# Altium schematic sheet LED Lamp Interfaces.SchDoc
size A4; Organization: TESLA Motors, INC; Address1: 3500 Deer Creek Road; Address2: Palo Alto, CA; Address4: U.S.A.; SheetNumber: 17; SheetTotal: 21
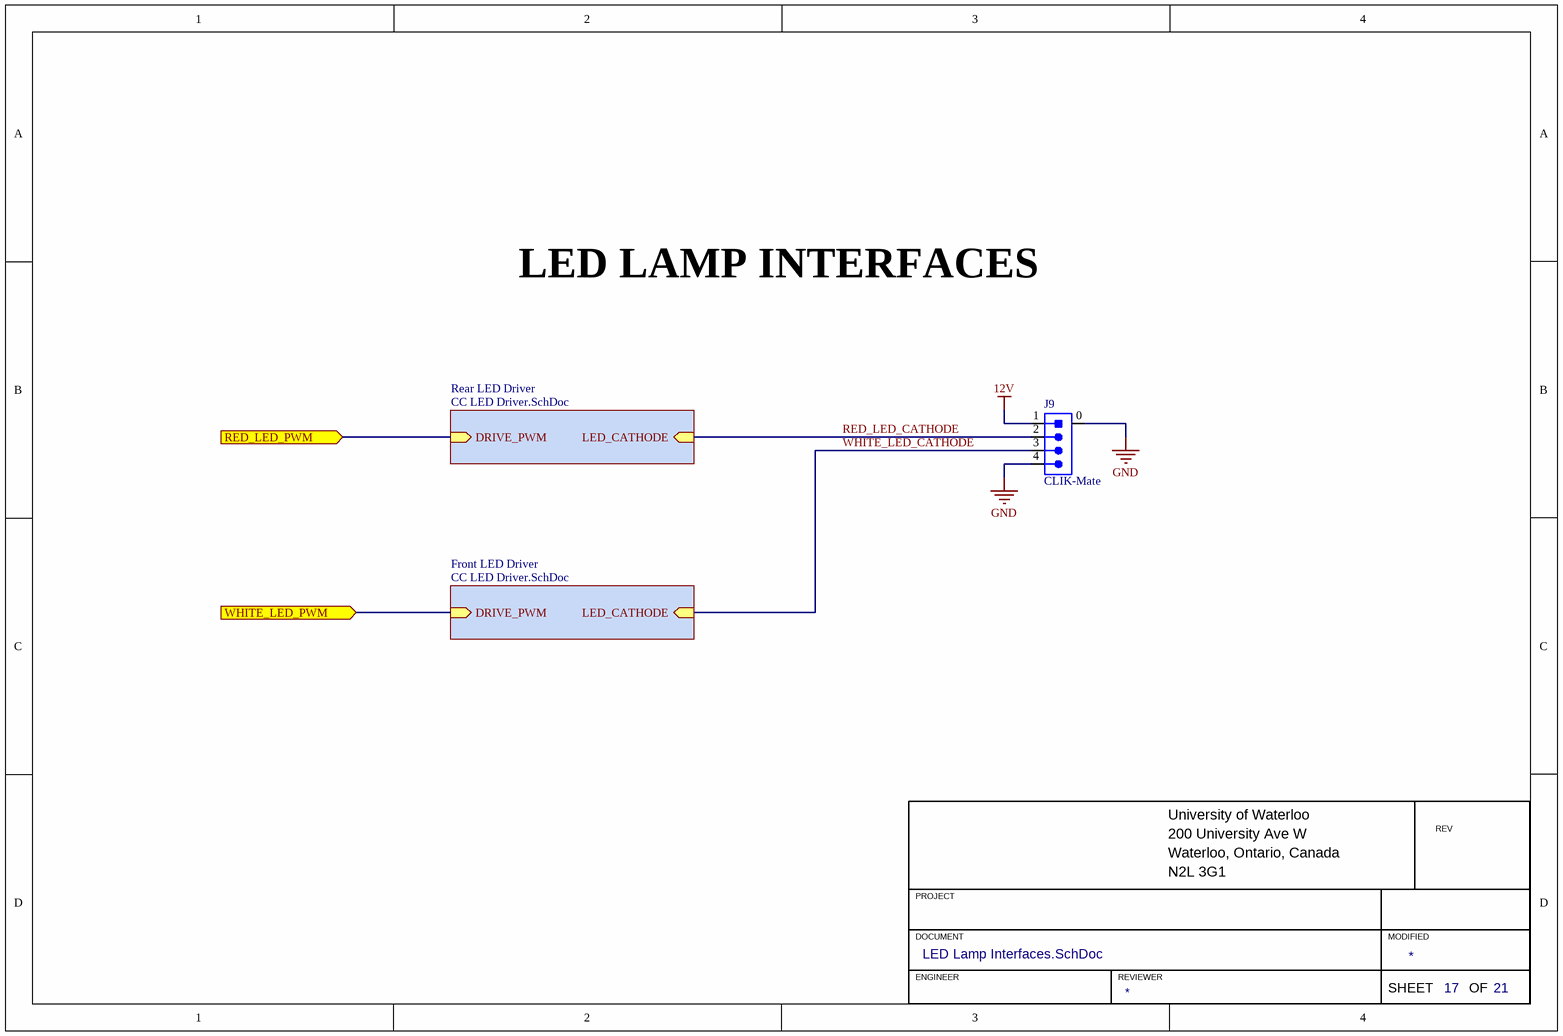
[diagram p0: LED Lamp Interfaces.SchDoc]

## Parts
J9  Family: CLIK-Mate  [MOLEX-5025850470]  (hidden comment: CON_4M_SM_RA)

## Sub-sheets
Front LED Driver = CC LED Driver.SchDoc: LED_CATHODE (in), DRIVE_PWM (in)
Rear LED Driver = CC LED Driver.SchDoc: LED_CATHODE (in), DRIVE_PWM (in)

## Ports
RED_LED_PWM (in), WHITE_LED_PWM (in)

## Nets
12V: J9.1
GND: J9.0 J9.4
RED_LED_CATHODE: J9.2 ; sheet Rear LED Driver/LED_CATHODE
RED_LED_PWM: port RED_LED_PWM, sheet Rear LED Driver/DRIVE_PWM
WHITE_LED_CATHODE: J9.3 ; sheet Front LED Driver/LED_CATHODE
WHITE_LED_PWM: port WHITE_LED_PWM, sheet Front LED Driver/DRIVE_PWM

## Notes on the sheet
- LED LAMP INTERFACES
- University of Waterloo
- 200 University Ave W
- REV
- PROJECT
- Waterloo, Ontario, Canada
- N2L 3G1
- DOCUMENT
- ENGINEER
- REVIEWER
- MODIFIED
- SHEET
- OF

## Library data of the parts
J9 = CON_4M_SM_RA: CONN HEADER SMD RIGHT ANGLE 1.5 MM PITCH; Supplier 1: Digi-Key; Supplier Part Number 1: WM9449CT-ND; Package/Footprint: SMD; Mounting Type: SMD